# EAGLE design v1 (EAGLE 6.5.0)
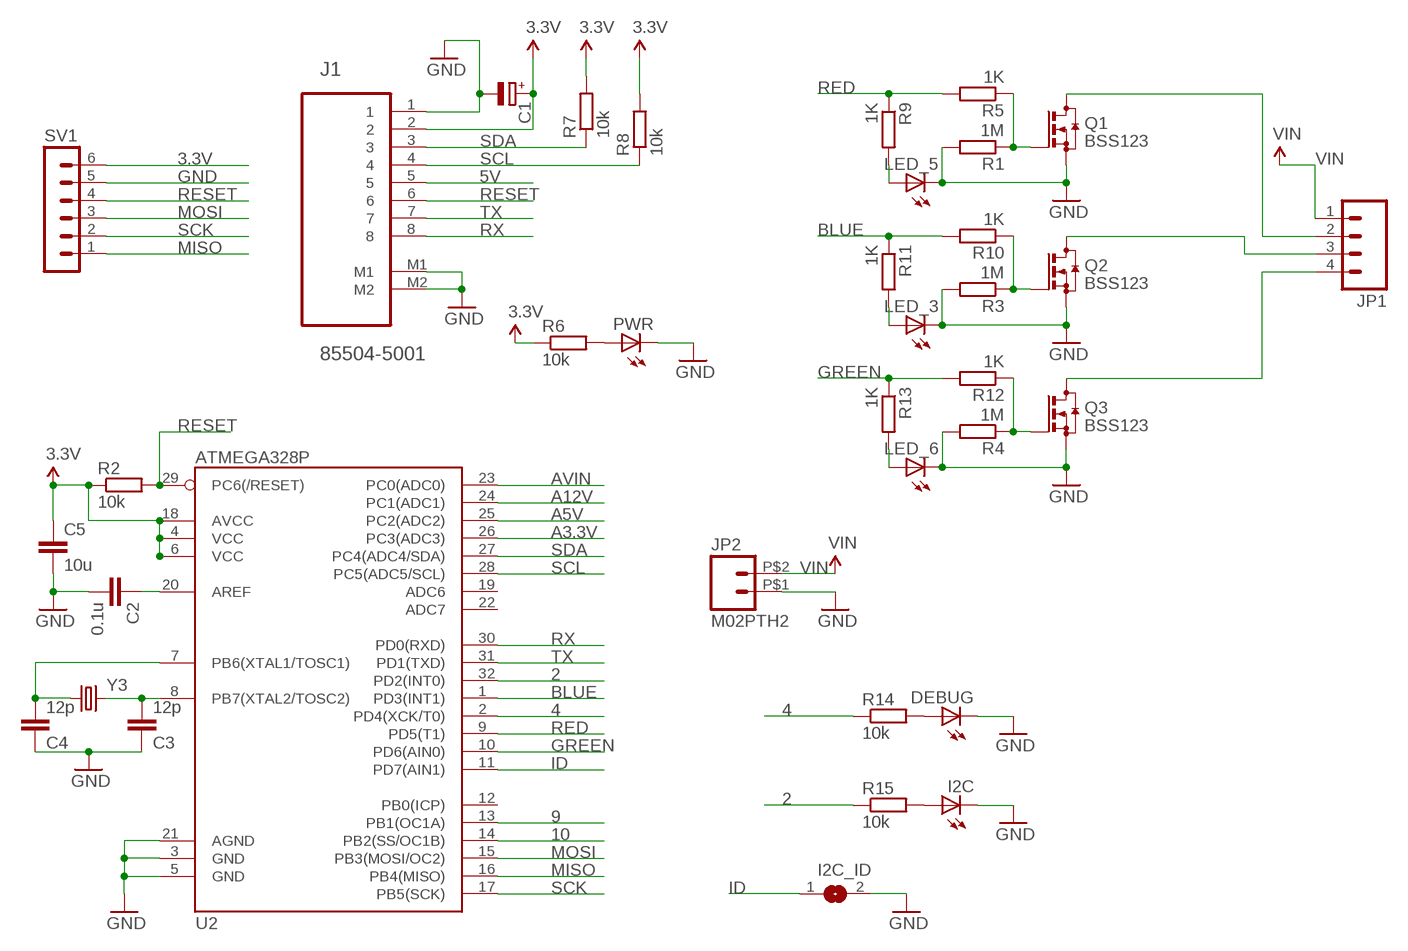
[diagram p0: schematic, sheet 1]

## Parts
C1  CPOL-EUE2.5-6  [E2,5-6]
C2  0.1u  C-EUC0805  [C0805]
C3  12p  C-EUC0805  [C0805]
C4  12p  C-EUC0805  [C0805]
C5  10u  C-EUC0805  [C0805]
DEBUG  LEDSML0805  [SML0805]
I2C  LEDSML0805  [SML0805]
I2C_ID  SJ  [SJ]
J1  85504-5001  [MOLEX_85504-5001]
JP1  M04POLAR  [MOLEX-1X4]
JP2  M02PTH2  [1X02_BIG]
LED_3  LEDSML0805  [SML0805]
LED_5  LEDSML0805  [SML0805]
LED_6  LEDSML0805  [SML0805]
PWR  LEDSML0805  [SML0805]
Q1  BSS123  [SOT23]
Q2  BSS123  [SOT23]
Q3  BSS123  [SOT23]
R1  1M  R-EU_R0805  [R0805]
R2  10k  R-EU_R0805  [R0805]
R3  1M  R-EU_R0805  [R0805]
R4  1M  R-EU_R0805  [R0805]
R5  1K  R-EU_R0805  [R0805]
R6  10k  R-EU_R0805  [R0805]
R7  10k  R-EU_R0805  [R0805]
R8  10k  R-EU_R0805  [R0805]
R9  1K  R-EU_R0805  [R0805]
R10  1K  R-EU_R0805  [R0805]
R11  1K  R-EU_R0805  [R0805]
R12  1K  R-EU_R0805  [R0805]
R13  1K  R-EU_R0805  [R0805]
R14  10k  R-EU_R0805  [R0805]
R15  10k  R-EU_R0805  [R0805]
SV1  MA06-1  [MA06-1]
U2  ATMEGA328P  ATMEGA328_SMT  [TQFP32-08]
Y3  CRYSTALCRYSTAL-SMD-5X3-LARGEPAD  [CRYSTAL-SMD-5X3]

## Nets
2: R15.1 U2.32(PD2(INT0))
3.3V: C1.+ C5.1 J1.2 R2.1 R6.1 R7.2 R8.2 SV1.6 U2.4(VCC) U2.6(VCC) U2.18(AVCC)
4: R14.1 U2.2(PD4(XCK/T0))
5V: J1.5
9: U2.13(PB1(OC1A))
10: U2.14(PB2(SS/OC1B))
A3.3V: U2.26(PC3(ADC3))
A5V: U2.25(PC2(ADC2))
A12V: U2.24(PC1(ADC1))
AVIN: U2.23(PC0(ADC0))
BLUE: R10.2 R11.1 U2.1(PD3(INT1))
GND: C1.- C2.2 C3.1 C4.1 C5.2 DEBUG.C I2C.C I2C_ID.2 J1.1 J1.M1 J1.M2 JP2.P$1 LED_3.C LED_5.C LED_6.C PWR.C Q1.2(S) Q2.2(S) Q3.2(S) R1.2 R3.2 R4.2 SV1.5 U2.3(GND) U2.5(GND) U2.21(AGND)
GREEN: R12.2 R13.1 U2.10(PD6(AIN0))
ID: I2C_ID.1 U2.11(PD7(AIN1))
MISO: SV1.1 U2.16(PB4(MISO))
MOSI: SV1.3 U2.15(PB3(MOSI/OC2))
N$1: JP1.2 Q1.3(D)
N$2: C2.1 U2.20(AREF)
N$3: C3.2 U2.8(PB7(XTAL2/TOSC2)) Y3.3
N$4: C4.2 U2.7(PB6(XTAL1/TOSC1)) Y3.1
N$5: JP1.3 Q2.3(D)
N$6: JP1.4 Q3.3(D)
N$7: Q1.1(G) R1.1 R5.1
N$8: Q2.1(G) R3.1 R10.1
N$9: Q3.1(G) R4.1 R12.1
N$10: DEBUG.A R14.2
N$11: PWR.A R6.2
N$12: I2C.A R15.2
N$13: LED_5.A R9.2
N$15: LED_3.A R11.2
N$16: LED_6.A R13.2
RED: R5.2 R9.1 U2.9(PD5(T1))
RESET: J1.6 R2.2 SV1.4 U2.29(PC6(/RESET))
RX: J1.8 U2.30(PD0(RXD))
SCK: SV1.2 U2.17(PB5(SCK))
SCL: J1.4 R8.1 U2.28(PC5(ADC5/SCL))
SDA: J1.3 R7.1 U2.27(PC4(ADC4/SDA))
TX: J1.7 U2.31(PD1(TXD))
VIN: JP1.1 JP2.P$2
Unconnected: U2.12(PB0(ICP)) U2.19(ADC6) U2.22(ADC7)

## Library data of the parts
C1 = rcl:CPOL-EU: POLARIZED CAPACITOR, European symbol
C2-C5 = rcl:C-EU: CAPACITOR, European symbol
DEBUG I2C LED_3 LED_5 LED_6 PWR = led:LED: LED OSRAM: - CHIPLED LG R971, LG N971, LY N971, LG Q971, LY Q971, LO R971, LY R971 LH N974, LH R974 LS Q976, LO Q976, LY Q976 LO Q996 - Hyper CHIPLED LW Q18S LB Q993, LB Q99A, LB R99A - SideLED LS A670, LO A670, LY A670, LG A670, LP A670 LB A673, LV A673, LT A673, LW A673 LH A674 LY A675 LS A676, LA A676, LO A676, LY A676, LW A676 LS A679, LY A679, LG A679 - Hyper Micro SIDELED® LS Y876, LA Y876, LO Y876, LY Y876 LT Y87S - SmartLED LW L88C, LW L88S LB L89C, LB L89S, LG L890 LS L89K, LO L89K, LY L89K LS L896, LA L896, LO L896, LY L896 - TOPLED LS T670, LO T670, LY T670, LG T670, LP T670 LSG T670, LSP T670, LSY T670, LOP T670, LYG T670 LG T671, LOG T671, LSG T671 LB T673, LV T673, LT T673, LW T673 LH T674 LS T676, LA T676, LO T676, LY T676, LB T676, LH T676, LSB T676, LW T676 LB T67C, LV T67C, LT T67C, LS T67K, LO T67K, LY T67K, LW E67C LS E67B, LA E67B, LO E67B, LY E67B, LB E67C, LV E67C, LT E67C LW T67C LS T679, LY T679, LG T679 LS T770, LO T770, LY T770, LG T770, LP T770 LB T773, LV T773, LT T773, LW T773 LH T774 LS E675, LA E675, LY E675, LS T675 LS T776, LA T776, LO T776, LY T776, LB T776 LHGB T686 LT T68C, LB T68C - Hyper Mini TOPLED® LB M676 - Mini TOPLED Santana® LG M470 LS M47K, LO M47K, LY M47K Source: http://www.osram.convergy.de LUXEON: - LUMILED® LXK2-PW12-R00, LXK2-PW12-S00, LXK2-PW14-U00, LXK2-PW14-V00 LXK2-PM12-R00, LXK2-PM12-S00, LXK2-PM14-U00 LXK2-PE12-Q00, LXK2-PE12-R00, LXK2-PE12-S00, LXK2-PE14-T00, LXK2-PE14-U00 LXK2-PB12-K00, LXK2-PB12-L00, LXK2-PB12-M00, LXK2-PB14-N00, LXK2-PB14-P00, LXK2-PB14-Q00 LXK2-PR12-L00, LXK2-PR12-M00, LXK2-PR14-Q00, LXK2-PR14-R00 LXK2-PD12-Q00, LXK2-PD12-R00, LXK2-PD12-S00 LXK2-PH12-R00, LXK2-PH12-S00 LXK2-PL12-P00, LXK2-PL12-Q00, LXK2-PL12-R00 Source: www.luxeon.com KINGBRIGHT: KA-3528ASYC Source: www.kingbright.com
I2C_ID = jumper:SJ: SMD solder JUMPER
J1 = Molex-8550x-xxxx:85504-5001: CONNECTOR, RJ45, JACK, 8P8C, 1PORT, CAT5; MPN: 85504-5001; OC_FARNELL: 2313732; OC_NEWARK: 96W3689; PACKAGE: RJ45, JACK, 8P8C; SUPPLIER: MOLEX
JP1 = SparkFun-Connectors:M04: Header 4 Standard 4-pin 0.1" header. Use with straight break away headers (SKU : PRT-00116), right angle break away headers (PRT-00553), swiss pins (PRT-00743), machine pins (PRT-00117), and female headers (PRT-00115). Molex polarized connector foot print use with SKU : PRT-08231 with associated crimp pins and housings. 1MM SMD Version SKU: PRT-10208
JP2 = SparkFun-Connectors:M02: Standard 2-pin 0.1" header. Use with - straight break away headers ( PRT-00116) - right angle break away headers (PRT-00553) - swiss pins (PRT-00743) - machine pins (PRT-00117) - female headers (PRT-00115) Molex polarized connector foot print use with: PRT-08233 with associated crimp pins and housings. 2.54_SCREWTERM for use with PRT-10571. 3.5mm Screw Terminal footprints for PRT-08084 5mm Screw Terminal footprints for use with PRT-08433
Q1-Q3 = transistor-small-signal:BSS123: N-CHANNEL MOS FET
R1-R15 = rcl:R-EU_: RESISTOR, European symbol
SV1 = con-lstb:MA06-1: PIN HEADER; OC_FARNELL: unknown; OC_NEWARK: unknown
U2 = SparkFun-DigitalIC:ATMEGA328_SMT: 32-Pin Atmega328 part Commonly used on Arduino compatible boards Available in QFP and QFN packages TQFP is IC-09069 QFN is non-stock; PROD_ID: IC-09069
Y3 = SparkFun-FreqCtrl:CRYSTAL: Various standard crystals. Proven footprints. Spark Fun Electronics SKU : COM-00534

## Board
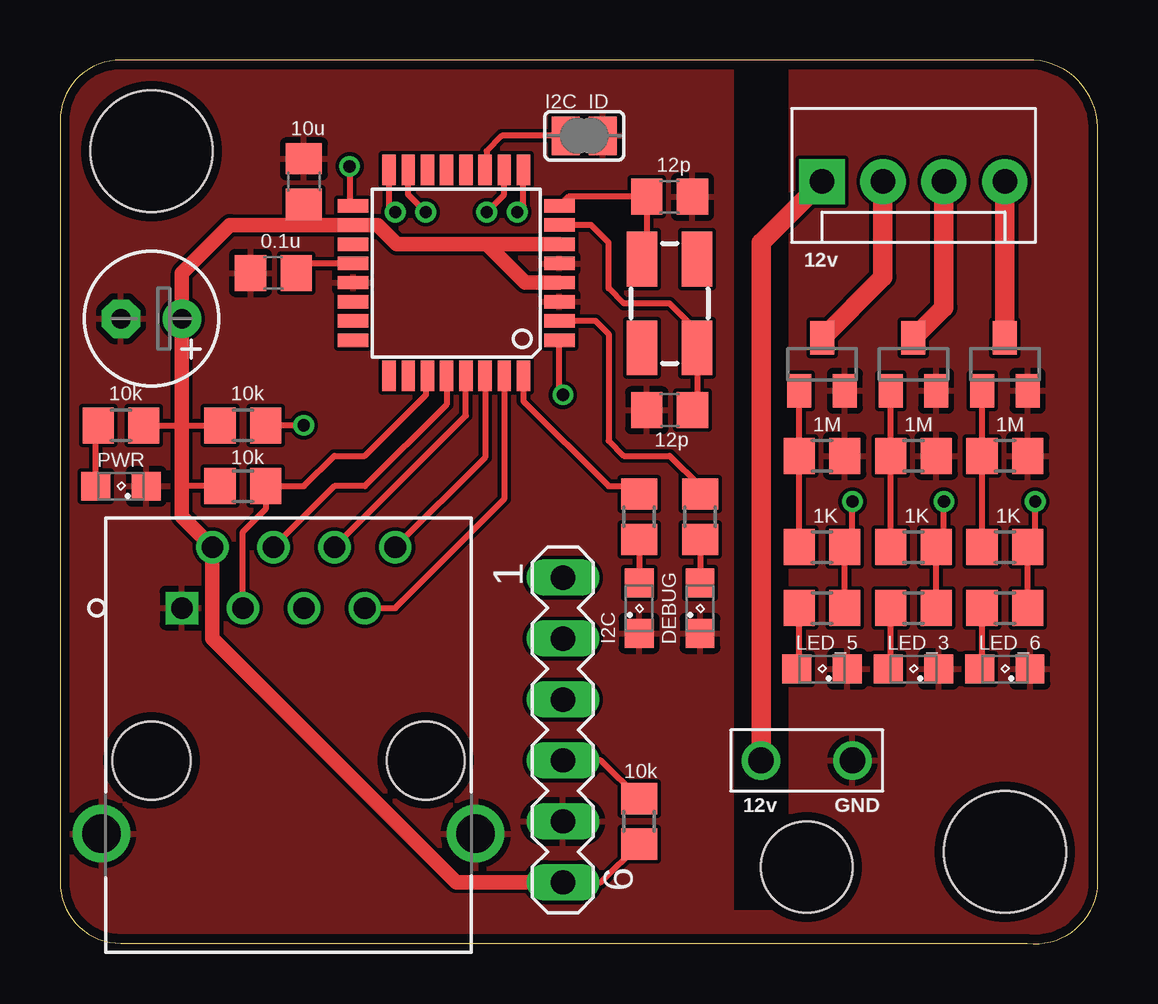
[diagram p1: board, top side]
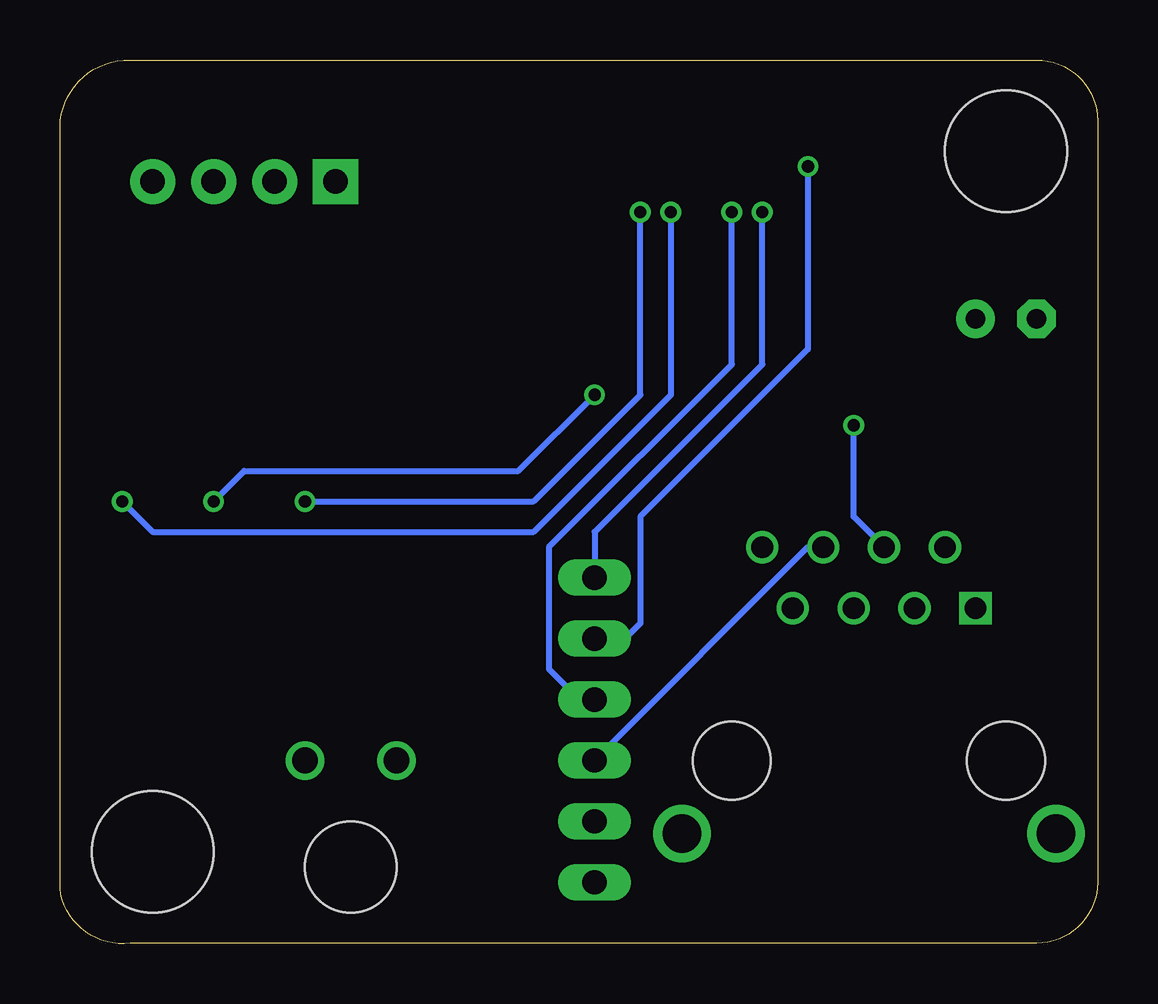
[diagram p2: board, bottom side, seen from below]

Size 43.23 x 36.84 mm. Coordinates in mm from the lower left corner, seen from the top.
Outline: 0,34.3 0,2.56 arc90 2.54,0.02 40.31,0.02 arc90 43.23,2.3 43.23,34.04 arc90 40.31,36.84 2.54,36.84 arc90 0,34.3
Copper layers (1*16): Top 0.0356mm / dielectric 1.5011mm / Bottom 0.0356mm
Design rules "LaenPCBOrder": minimum track width 6mil, minimum drill 13mil, track to track 6mil, track to pad 6mil, pad to pad 6mil, via to via 6mil, smd to smd 6mil, copper to edge 15mil, drill to drill 6mil, minimum pad ring 7mil, minimum via ring 7mil, stop-mask expansion 3mil, vias tented up to drill 0mil, thermal gap 10mil
Holes 5.08 mm at 3.81,33.04 39.37,3.83
Holes 3.81 mm at 31.11,3.19

### Footprints (pad centres in the part's own frame; a part is rotated, then mirrored left to right if it is on the bottom)
E2,5-6 = drill 0.813 pad 1.6: + -1.27,0 | drill 0.813 pad 1.6 octagon: - 1.27,0
C0805 = smd 1.3 x 1.5: 1 -0.95,0; 2 0.95,0
SML0805 = smd 1.2 x 1.2: A 1.05,0; C -1.05,0
SJ = smd 1.168 x 1.6: 1 -0.762,0; 2 0.762,0
MOLEX_85504-5001 = drill 0.9 square: 1 0,0 | drill 0.9: 2 1.27,2.54; 3 2.54,0; 4 3.81,2.54; 5 5.08,0; 6 6.35,2.54; 7 7.62,0; 8 8.89,2.54 | drill 1.6: M1 -3.35,-9.4; M2 12.24,-9.4 | hole 3.25: -1.27,-6.35; 10.16,-6.35
MOLEX-1X4 = drill 1.016 pad 1.88 square: 1 0,0 | drill 1.016 pad 1.88: 2 2.54,0; 3 5.08,0; 4 7.62,0
1X02_BIG = drill 1.067: P$1 0,0; P$2 3.81,0
SOT23 = smd 1 x 1.4: 1 -0.95,-1.1; 2 0.95,-1.1; 3 0,1.1
R0805 = smd 1.3 x 1.5: 1 -0.95,0; 2 0.95,0
MA06-1 = drill 1.016 long: 1 -6.35,0; 2 -3.81,0; 3 -1.27,0; 4 1.27,0; 5 3.81,0; 6 6.35,0
TQFP32-08 = smd 1.27 x 0.559: 1 -4.293,2.8; 2 -4.293,2; 3 -4.293,1.2; 4 -4.293,0.4; 5 -4.293,-0.4; 6 -4.293,-1.2; 7 -4.293,-2; 8 -4.293,-2.8; 17 4.293,-2.8; 18 4.293,-2; 19 4.293,-1.2; 20 4.293,-0.4; 21 4.293,0.4; 22 4.293,1.2; 23 4.293,2; 24 4.293,2.8 | smd 0.559 x 1.27: 9 -2.8,-4.293; 10 -2,-4.293; 11 -1.2,-4.293; 12 -0.4,-4.293; 13 0.4,-4.293; 14 1.2,-4.293; 15 2,-4.293; 16 2.8,-4.293; 25 2.8,4.293; 26 2,4.293; 27 1.2,4.293; 28 0.4,4.293; 29 -0.4,4.293; 30 -1.2,4.293; 31 -2,4.293; 32 -2.8,4.293
CRYSTAL-SMD-5X3 = smd 2.286 x 1.27: 1 -1.85,-1.15; 2 1.85,-1.15; 3 1.85,1.15; 4 -1.85,1.15

### Placement (x,y rotation side)
C1  3.81,26.05 180 top
C2  8.89,27.96 180 top
C3  25.4,31.13 180 top
C4  25.4,22.24 0 top
C5  10.16,31.77 90 top
DEBUG  26.67,13.99 90 top
I2C  24.13,13.99 90 top
I2C_ID  21.84,33.67 0 top
J1  5.08,13.99 0 top
JP1  31.75,31.77 0 top
JP2  33.02,7.64 180 top
LED_3  35.56,11.45 180 top
LED_5  31.75,11.45 180 top
LED_6  39.37,11.45 180 top
PWR  2.54,19.07 180 top
Q1  31.75,24.15 0 top
Q2  35.56,24.15 0 top
Q3  39.37,24.15 0 top
R1  31.75,20.34 0 top
R2  24.13,5.1 90 top
R3  35.56,20.34 0 top
R4  39.37,20.34 0 top
R5  31.75,16.53 0 top
R6  2.54,21.61 180 top
R7  7.62,19.07 180 top
R8  7.62,21.61 180 top
R9  31.75,13.99 180 top
R10  35.56,16.53 0 top
R11  35.56,13.99 180 top
R12  39.37,16.53 0 top
R13  39.37,13.99 180 top
R14  26.67,17.8 270 top
R15  24.13,17.8 270 top
SV1  20.95,8.91 270 top
U2  16.51,27.96 180 top
Y3  25.4,26.69 90 top

### Tracks (layer width: path | path; a pad name or v marks a point on that pad's centre or on a via)
2
  Top 0.254: U2.32 19.31,22.62 22.86,19.07 23.81,19.07 R15.1
3.3V
  Top 0.254: SV1.6 22.54,2.56 R2.1 | C5.1 10.16,29.96 | R6.1 5.08,21.61 R8.2 | R7.2 5.08,19.07
  Top 0.61: 17.78,29.16 14.04,29.16 13.24,29.96 U2.18 10.16,29.96 7.08,29.96 5.08,27.96 5.08,26.69 C1.+ 5.08,21.61 5.08,19.07 5.08,17.8 J1.2 6.35,12.72 16.51,2.56 SV1.6 | 17.78,29.16 U2.6 | U2.4 19.38,27.56 17.78,29.16
4
  Top 0.254: U2.2 22.32,25.96 22.86,25.42 22.86,20.97 23.5,20.34 25.4,20.34 26.67,19.07 R14.1
BLUE  (via drill 0.51)
  Top 0.254: v36.83,18.43 36.83,16.85 R10.2 R11.1 | v20.95,22.88 20.8,23.03 U2.1
  Bottom 0.254: v36.83,18.43 35.56,19.7 24.13,19.7 v20.95,22.88
GND
  pour Top (rank 4): 40.64,0.02 2.54,0.02 arc-90 0,2.56 0,34.31 arc-90 2.54,36.85 27.94,36.85 27.94,1.29 30.48,1.29 30.48,36.85 40.64,36.85 arc-90 43.18,34.31 43.18,2.56 arc-90
GREEN  (via drill 0.51)
  Top 0.254: v40.64,18.43 40.64,16.85 R12.2 R13.1 | v17.78,30.5 18.51,31.23 U2.10
  Bottom 0.254: v40.64,18.43 39.37,17.16 23.5,17.16 17.78,22.88 v17.78,30.5
ID
  Top 0.254: I2C_ID.1 18.41,33.67 17.78,33.04 17.78,32.32 U2.11
MISO  (via drill 0.51)
  Top 0.254: v13.97,30.5 13.71,30.76 U2.16
  Bottom 0.254: v13.97,30.5 13.97,24.15 20.95,17.16 SV1.1
MOSI  (via drill 0.51)
  Top 0.254: v15.24,30.5 14.51,31.23 U2.15
  Bottom 0.254: v15.24,30.5 15.24,24.15 22.86,16.53 22.86,11.45 21.59,10.18 SV1.3
N$1
  Top 0.813: Q1.3 34.29,27.79 JP1.2
N$2
  Top 0.254: U2.20 10.24,28.36 arc90 C2.1
N$3
  Top 0.254: Y3.3 24.45,28.74 C3.2 21.18,31.13 U2.8
N$4
  Top 0.254: C4.2 26.55,21.81 Y3.1 26.55,25.54 25.4,26.69 23.5,26.69 22.86,27.32 22.86,29.23 22.13,29.96 U2.7
N$5
  Top 0.813: Q2.3 36.83,26.52 JP1.3
N$6
  Top 0.813: JP1.4 Q3.3
N$7
  Top 0.254: R5.1 R1.1 Q1.1
N$8
  Top 0.254: R10.1 R3.1 Q2.1
N$9
  Top 0.254: R12.1 R4.1 Q3.1
N$10
  Top 0.254: R14.2 DEBUG.A
N$11
  Top 0.254: PWR.A 1.49,21.51 R6.2
N$12
  Top 0.254: R15.2 I2C.A
N$13
  Top 0.254: LED_5.A 30.8,11.55 R9.2
N$15
  Top 0.254: LED_3.A 34.61,11.55 R11.2
N$16
  Top 0.254: LED_6.A 38.42,11.55 R13.2
RED  (via drill 0.51)
  Top 0.254: v33.02,18.43 33.02,16.85 R5.2 R9.1 | v19.05,30.5 19.31,30.76 U2.9
  Bottom 0.254: v33.02,18.43 23.5,18.43 19.05,22.88 v19.05,30.5
RESET
  Top 0.254: R2.2 22.54,7.64 SV1.4 | J1.6 16.91,22.01 U2.29
  Bottom 0.254: J1.6 12.06,16.53 SV1.4
RX
  Top 0.254: U2.30 17.71,20.27 J1.8
SCK  (via drill 0.51)
  Top 0.254: v12.06,32.4 12.06,30.91 U2.17
  Bottom 0.254: SV1.2 19.68,12.72 19.05,13.35 19.05,17.8 12.06,24.78 v12.06,32.4
SCL  (via drill 0.51)
  Top 0.254: v10.16,21.61 R8.1 | U2.28 16.11,22.48 12.7,19.07 11.43,19.07 J1.4
  Bottom 0.254: J1.4 10.16,17.8 v10.16,21.61
SDA
  Top 0.254: U2.27 15.24,23.6 15.24,22.88 12.7,20.34 11.43,20.34 10.16,19.07 R7.1 8.57,18.11 7.62,17.16 J1.3
TX
  Top 0.254: J1.7 13.97,13.99 18.51,18.53 U2.31
VIN
  Top 0.813: JP2.P$2 29.21,29.23 JP1.1

### Text on the board
_tsilk: 12v | 12v | GND
_bsilk: v1